# EAGLE design 549-anamdev-forceSensor (EAGLE 8.0.0)

## Sheet 1 of 2
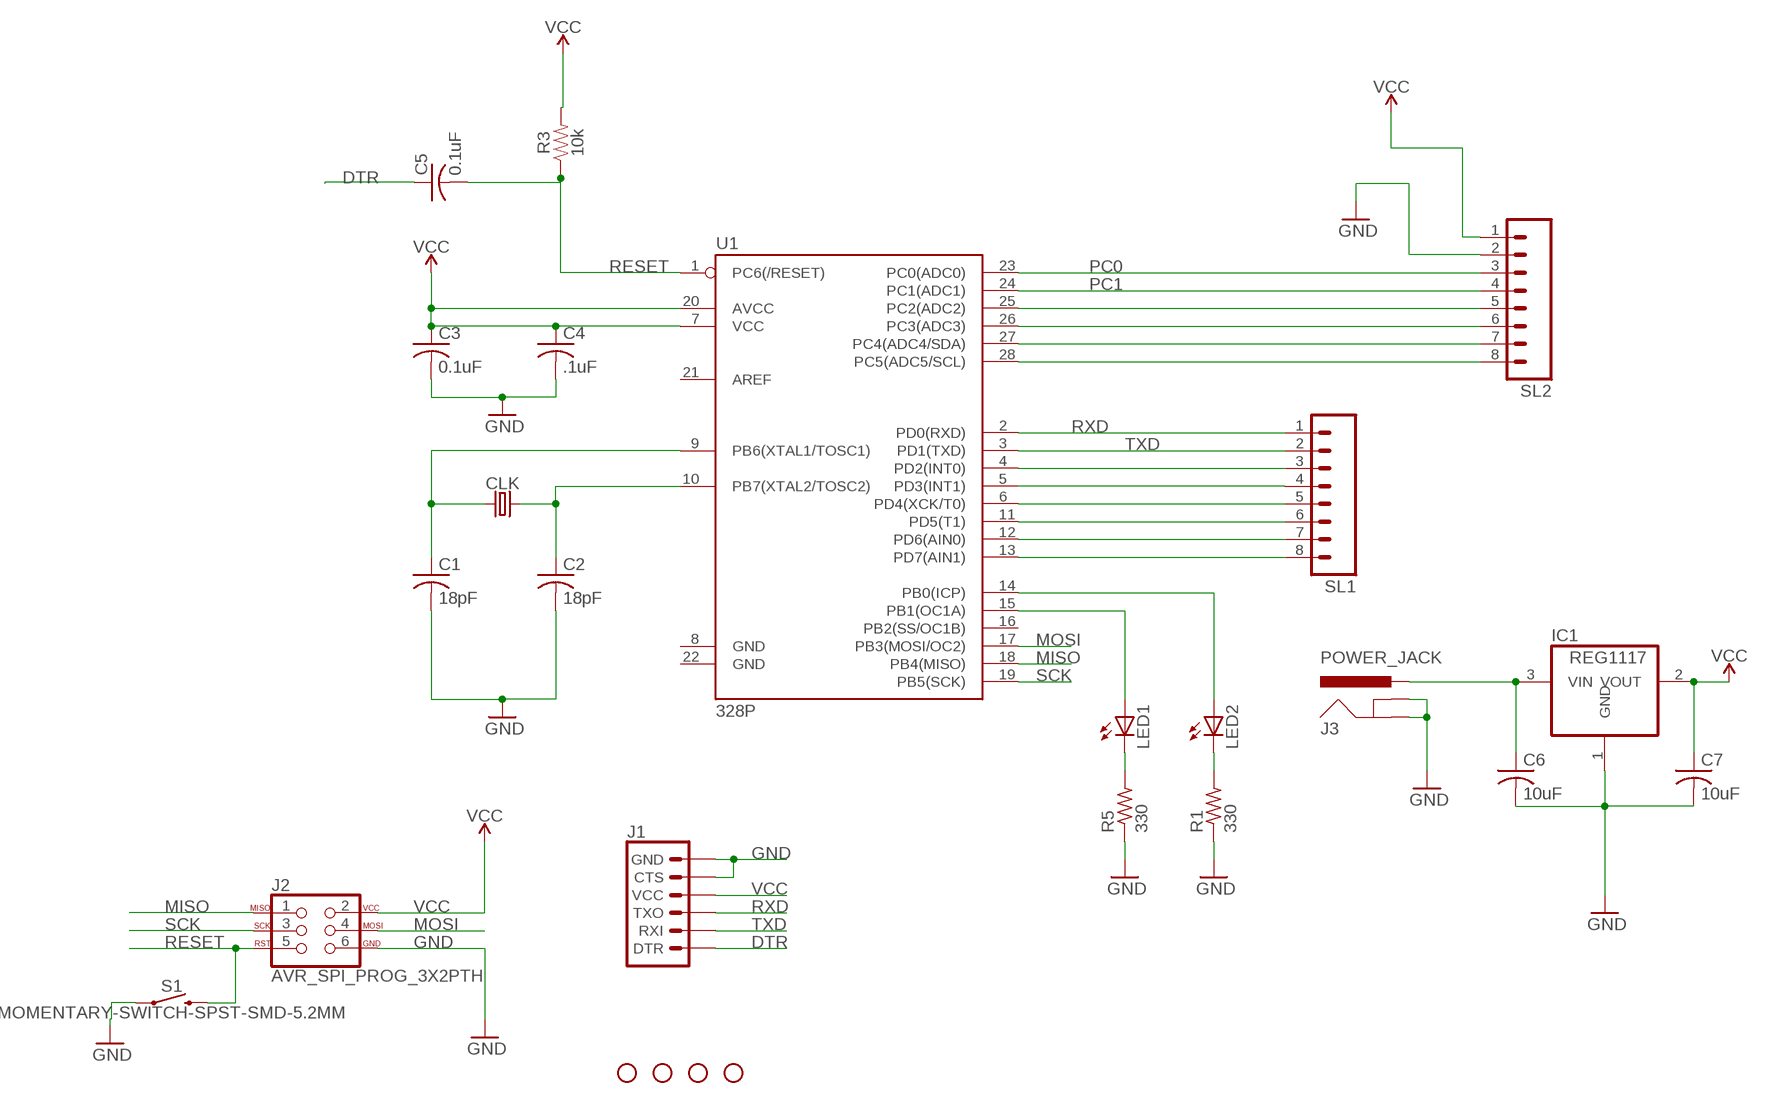
[diagram p0: schematic, sheet 1]

### Parts
C1  18pF  C-USC1206  [C1206]
C2  18pF  C-USC1206  [C1206]
C3  0.1uF  C-USC1206  [C1206]
C4  .1uF  C-USC1206  [C1206]
C5  0.1uF  C-USC1206  [C1206]
C6  10uF  C-USC1206  [C1206]
C7  10uF  C-USC1206  [C1206]
CLK  CRYSTALSMD-HC49UP  [HC49UP]
H1  STAND-OFF  [STAND-OFF]
H2  STAND-OFF  [STAND-OFF]
H3  STAND-OFF  [STAND-OFF]
H4  STAND-OFF  [STAND-OFF]
IC1  REG1117  [SOT223]
J1  6_PIN_SERIAL_TARGET  [1X06]
J2  AVR_SPI_PROG_3X2PTH  [2X3]
J3  POWER_JACK  [POWER_JACK_PTH]
LED1  LED1206  [LED-1206]
LED2  LED1206  [LED-1206]
R1  330  R-US_R1206  [R1206]
R3  10k  10OHM-1206-1/4W-1%  [1206]
R5  330  R-US_R1206  [R1206]
S1  MOMENTARY-SWITCH-SPST-SMD-5.2MM  [TACTILE_SWITCH_SMD_5.2MM]
SL1  M08  [08P]
SL2  M08  [08P]
U1  328P  ATMEGA328P_PDIP  [DIP28]

### Nets
DTR: C5.1 J1.1(DTR)
GND: C1.2 C2.2 C3.2 C4.2 C6.2 C7.2 IC1.1(GND) J1.5(CTS) J1.6(GND) J2.6 J3.GND J3.GNDBREAK R1.1 R5.1 S1.1 SL2.2 ; also sheet 2
MISO: J2.1 U1.18(PB4(MISO))
MOSI: J2.4 U1.17(PB3(MOSI/OC2))
N$1: LED2.A U1.14(PB0(ICP))
N$2: LED1.C R5.2
N$3: LED1.A U1.15(PB1(OC1A))
N$4: LED2.C R1.2
N$5: C6.1 IC1.3(VIN) J3.PWR
N$7: SL2.6 U1.26(PC3(ADC3))
N$9: SL1.5 U1.6(PD4(XCK/T0))
N$10: SL1.6 U1.11(PD5(T1))
N$11: SL1.7 U1.12(PD6(AIN0))
N$12: SL1.8 U1.13(PD7(AIN1))
N$14: SL1.3 U1.4(PD2(INT0))
N$15: SL1.4 U1.5(PD3(INT1))
N$21: C1.1 CLK.1 U1.9(PB6(XTAL1/TOSC1))
N$22: C2.1 CLK.2 U1.10(PB7(XTAL2/TOSC2))
PC0: SL2.3 U1.23(PC0(ADC0)) ; also sheet 2
PC1: SL2.4 U1.24(PC1(ADC1)) ; also sheet 2
PC2: SL2.5 U1.25(PC2(ADC2))
RESET: C5.2 J2.5 R3.1 S1.3 U1.1(PC6(/RESET))
RXD: J1.3(TXO) SL1.1 U1.2(PD0(RXD))
SCK: J2.3 U1.19(PB5(SCK)) ; also sheet 2
SCL: SL2.8 U1.28(PC5(ADC5/SCL))
SDA: SL2.7 U1.27(PC4(ADC4/SDA))
TXD: J1.2(RXI) SL1.2 U1.3(PD1(TXD))
VCC: C3.1 C4.1 C7.1 IC1.2(VOUT) J1.4(VCC) J2.2 R3.2 SL2.1 U1.7(VCC) U1.20(AVCC) ; also sheet 2
Unconnected: U1.8(GND) U1.16(PB2(SS/OC1B)) U1.21(AREF) U1.22(GND)

## Sheet 2 of 2
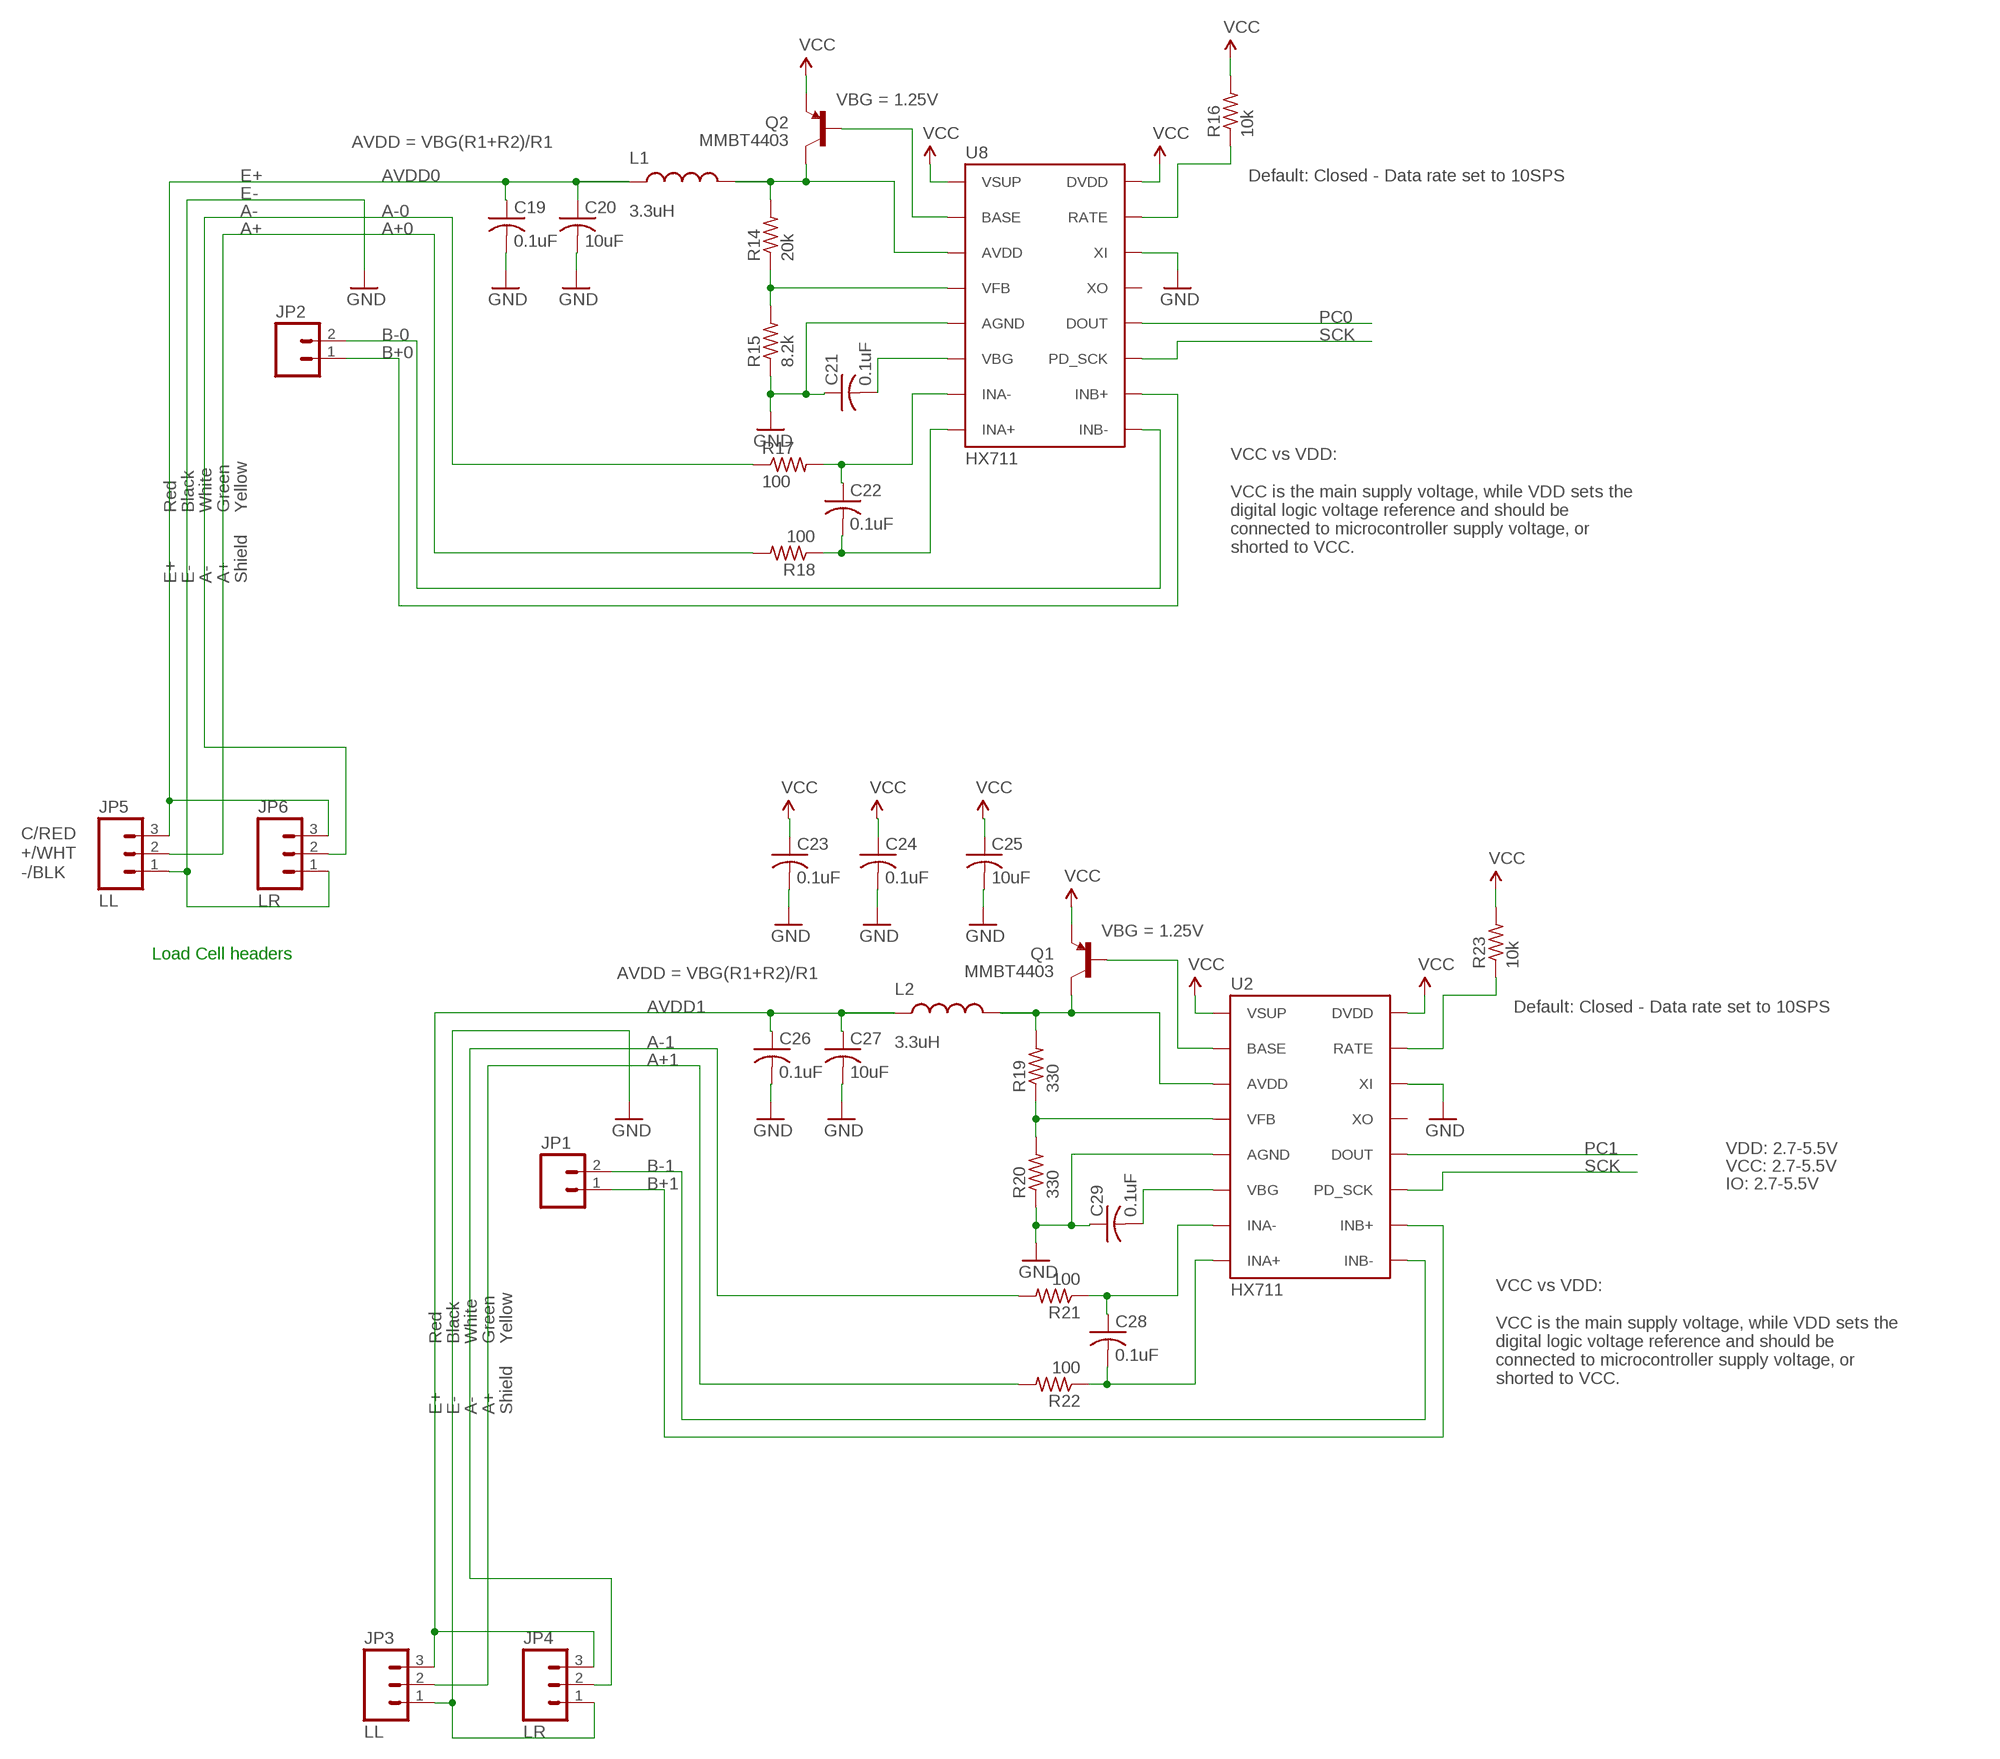
[diagram p1: schematic, sheet 2]

### Parts
C19  0.1uF  C-USC1206  [C1206]
C20  10uF  C-USC1206  [C1206]
C21  0.1uF  C-USC1206  [C1206]
C22  0.1uF  C-USC1206  [C1206]
C23  0.1uF  C-USC1206  [C1206]
C24  0.1uF  C-USC1206  [C1206]
C25  10uF  C-USC1206  [C1206]
C26  0.1uF  C-USC1206  [C1206]
C27  10uF  C-USC1206  [C1206]
C28  0.1uF  C-USC1206  [C1206]
C29  0.1uF  C-USC1206  [C1206]
JP1  M02PTH  [1X02]
JP2  M02PTH  [1X02]
JP3  LL  M03PTH  [1X03]
JP4  LR  M03PTH  [1X03]
JP5  LL  M03PTH  [1X03]
JP6  LR  M03PTH  [1X03]
L1  3.3uH  INDUCTOR0805-IND  [0805]
L2  3.3uH  INDUCTOR0805-IND  [0805]
Q1  MMBT4403  TRANSISTOR_PNPMMBT4403  [SOT23-3]
Q2  MMBT4403  TRANSISTOR_PNPMMBT4403  [SOT23-3]
R14  20k  R-US_R1206  [R1206]
R15  8.2k  R-US_R1206  [R1206]
R16  10k  R-US_R1206  [R1206]
R17  100  R-US_R1206  [R1206]
R18  100  R-US_R1206  [R1206]
R19  330  R-US_R1206  [R1206]
R20  330  R-US_R1206  [R1206]
R21  100  R-US_R1206  [R1206]
R22  100  R-US_R1206  [R1206]
R23  10k  R-US_R1206  [R1206]
U2  HX711  HX711HX711  [SO16]
U8  HX711  HX711HX711  [SO16]

### Nets
A+0: JP5.2 R18.2
A+1: JP3.2 R22.2
A-0: JP6.2 R17.1
A-1: JP4.2 R21.2
AVDD0: C19.1 C20.1 JP5.3 JP6.3 L1.1
AVDD1: C26.1 C27.1 JP3.3 JP4.3 L2.1
B+0: JP2.1 U8.10(INB+)
B+1: JP1.1 U2.10(INB+)
B-0: JP2.2 U8.9(INB-)
B-1: JP1.2 U2.9(INB-)
GND: C19.2 C20.2 C21.1 C23.2 C24.2 C25.2 C26.2 C27.2 C29.1 JP3.1 JP4.1 JP5.1 JP6.1 R15.1 R20.1 U2.5(AGND) U2.14(XI) U8.5(AGND) U8.14(XI) ; also sheet 1
N$6: Q2.1(B) U8.2(BASE)
N$8: R14.1 R15.2 U8.4(VFB)
N$13: C21.2 U8.6(VBG)
N$16: L1.2 Q2.3(C) R14.2 U8.3(AVDD)
N$17: R16.1 U8.15(RATE)
N$18: C22.1 R17.2 U8.7(INA-)
N$19: C22.2 R18.1 U8.8(INA+)
N$20: Q1.1(B) U2.2(BASE)
N$23: R19.1 R20.2 U2.4(VFB)
N$24: C29.2 U2.6(VBG)
N$25: L2.2 Q1.3(C) R19.2 U2.3(AVDD)
N$26: R23.1 U2.15(RATE)
N$27: C28.1 R21.1 U2.7(INA-)
N$28: C28.2 R22.1 U2.8(INA+)
PC0: U8.12(DOUT) ; also sheet 1
PC1: U2.12(DOUT) ; also sheet 1
SCK: U2.11(PD_SCK) U8.11(PD_SCK) ; also sheet 1
VCC: C23.1 C24.1 C25.1 Q1.2(E) Q2.2(E) R16.2 R23.2 U2.1(VSUP) U2.16(DVDD) U8.1(VSUP) U8.16(DVDD) ; also sheet 1
Unconnected: U2.13(XO) U8.13(XO)

### Notes on the sheet
- VBG = 1.25V
- AVDD = VBG(R1+R2)/R1
- E+ | Default: Closed - Data rate set to 10SPS
- E-
- A-
- A+
- Red | Black | White | Green | Yellow
- VCC vs VDD:
  
  VCC is the main supply voltage, while VDD sets the
  digital logic voltage reference and should be
  connected to microcontroller supply voltage, or
  shorted to VCC.
- E+ | E- | A- | A+ | Shield
- C/RED
- +/WHT
- -/BLK
- VBG = 1.25V
- Load Cell headers
- AVDD = VBG(R1+R2)/R1
- Default: Closed - Data rate set to 10SPS
- VDD: 2.7-5.5V
- VCC: 2.7-5.5V
- IO: 2.7-5.5V
- Red | Black | White | Green | Yellow
- VCC vs VDD:
  
  VCC is the main supply voltage, while VDD sets the
  digital logic voltage reference and should be
  connected to microcontroller supply voltage, or
  shorted to VCC.
- E+ | E- | A- | A+ | Shield

## Library data of the parts
C1-C7 C19-C29 = rcl:C-US: CAPACITOR, American symbol
CLK = SparkFun-Clocks:CRYSTAL: Crystals (Generic) These are passive quartz crystals, which can be used as a clock source for a microcontroller. Crystal's are two-terminal devices. They require external "load" capacitors to generate an oscillating signal.
H1-H4 = SparkFun-Hardware:STAND-OFF: Stand Off Drill holes for mechanically mounting via screws, standoffs, etc. Note: Use the keepout ring to avoid running the screw head into surrounding components. Variant Overviews STAND-OFF - Mechanical footprint for a #4 phillips button head screw. STAND-OFF-TIGHT - Mechanical footprint for a #4 phillips button head screw, Example SparkFun Products Screw - Phillips Head (1/4", 4-40, 10 pack) <https://www.sparkfun.com/products/10453> (PRT-10453) Screw - Phillips Head (1/2", 4-40, 10 pack) <https://www.sparkfun.com/products/10452> (PRT-10452) Screw - Phillips Head (3/4", 4-40, 10 pack) <https://www.sparkfun.com/products/10451> (PRT-10451) Screw - Phillips Head (1", 4-40, 10 pack) <https://www.sparkfun.com/products/10450> (PRT-10450)
IC1 = burr-brown:REG1117: 800mA and 1A Low Dropout (LDO) Positive Regulator 1.8V, 2.5V, 2.85V, 3.3V, 5V, and Adj; MPN: REG1117; OC_FARNELL: 1097566; OC_NEWARK: 14P6981
J1 = SparkFun-Connectors:6_PIN_SERIAL_TARGET: 6-pin header connection for use with the "FTDI BASIC" pinout - TARGET SIDE. Also known as "Arduino Serial Program Header". It is used to mate with our FTDI Basic serial programmers using the Arduino IDE. Note, this device has "TARGET" in the name. It is intended to be used on a design that contains a target micro-controller that you wish to program. The "sister" device, named "CABLE" is inteneded to be used on a design that usually lives on the end of your USB cable and prvides the converter chip (FTDI232 or FTDI231x) to commnicate serial RX/TX. You can populate with some of these: Break Away Headers - Straight <https://www.sparkfun.com/products/116> (PRT-00116) For reference (or to suit your programming needs) check out these designs: SparkFun FTDI Basic Breakout - 5V <https://www.sparkfun.com/products/9716> (DEV-09716) SparkFun FTDI Basic Breakout - 3.3V <https://www.sparkfun.com/products/9873> (DEV-09873) SparkFun FTDI SmartBasic <https://www.sparkfun.com/products/12935> (DEV-12935) SparkFun Beefy 3 - FTDI Basic Breakout <https://www.sparkfun.com/products/13746> (DEV-13746)
J2 = SparkFun-Connectors:AVR_SPI_PROG_3X2: AVR ISP 6 Pin This is the reduced ISP connector for AVR programming. Common on Arduino. This footprint will take up less PCB space and can be used with a 10-pin to 6-pin adapter such as SKU: BOB-08508 **Special note about "TEST_POINT" package. The stop mask is on the top side, so if you want your programming test points to be on the bottom of your board, make sure to place this package on the bottom side of the board. This also ensure that the orientation to program from the bottom side will be correct. SparkFun Products: SparkFun ISP Pogo Adapter <https://www.sparkfun.com/products/11591> - NS Tiny AVR Programmer <https://www.sparkfun.com/products/11801> -PTH
J3 = SparkFun-Connectors:POWER_JACK: Power Jack Connector This is the standard 5.5mm barrel jack for power. The PTH is the most common, proven, reliable, footprint. The Slot footprint only works if the mill layer is transmitted to the PCB fab house so be warned. Here are the connectors we sell at SparkFun: DC Barrel Power Jack/Connector <https://www.sparkfun.com/products/119> (PRT-00119) DC Barrel Power Jack/Connector (SMD) <https://www.sparkfun.com/products/12748> (PRT-12748) DC Barrel Jack Adapter - Breadboard Compatible <https://www.sparkfun.com/products/10811> (PRT-10811) It is used on this SparkFun product (and many, many others): SparkFun RedBoard - Programmed with Arduino <https://www.sparkfun.com/products/12757> (DEV-12757) Also, if you need a mating power supply or connector, please check these out: Wall Adapter Power Supply - 9VDC 650mA <https://www.sparkfun.com/products/298> (TOL-00298) DC Barrel Jack Adapter - Male <https://www.sparkfun.com/products/10287> (PRT-10287); PROD_ID: CONN-08197
JP1 JP2 = SparkFun-Connectors:M02: Standard 2-pin 0.1" header. Use with - straight break away headers ( PRT-00116) - right angle break away headers (PRT-00553) - swiss pins (PRT-00743) - machine pins (PRT-00117) - female headers (PRT-00115) Molex polarized connector foot print use with: PRT-08233 with associated crimp pins and housings. 2.54_SCREWTERM for use with PRT-10571. 3.5mm Screw Terminal footprints for PRT-08084 5mm Screw Terminal footprints for use with PRT-08432
JP3-JP6 = SparkFun-Connectors:M03: Header 3 Standard 3-pin 0.1" header. Use with straight break away headers (SKU : PRT-00116), right angle break away headers (PRT-00553), swiss pins (PRT-00743), machine pins (PRT-00117), and female headers (PRT-00115). Molex polarized connector foot print use with SKU : PRT-08232 with associated crimp pins and housings.
L1 L2 = SparkFun-Passives:INDUCTOR: Inductors Basic Inductor/Choke - 0603 and 1206. Footprints are not proven and vary greatly between part numbers. INDUCTOR POWER 3.3UH 4.0A SMD 0.197" L x 0.197" W x 0.177" H (5.00mm x 5.00mm x 4.50mm); PROD_ID: NDUC-13076
LED1 LED2 = SparkFun-Retired:LED: LEDs Standard schematic elements and footprints for 5mm, 3mm, 1206, and 0603 sized LEDs. 5mm - Spark Fun Electronics SKU : Comp-SBL
Q1 Q2 = SparkFun-DiscreteSemi:TRANSISTOR_PNP: Generic PNP BJT Double check pinouts against datasheets- not all devices are the same! MMBT3906 - 40V 200mA SOT-23 (TRANS-08052) MMBT4403 - 40V 600mA SOT-23 (TRANS-09245); PROD_ID: TRANS-09245
R1 R5 R14-R23 = rcl:R-US_: RESISTOR, American symbol
R3 = SparkFun-Resistors:10OHM: 10Ω resistor A resistor is a passive two-terminal electrical component that implements electrical resistance as a circuit element. Resistors act to reduce current flow, and, at the same time, act to lower voltage levels within circuits. - Wikipedia; PROD_ID: RES-08705; VALUE: 10
S1 = SparkFun-Switches:MOMENTARY-SWITCH-SPST: Momentary Switch (Pushbutton) - SPST Normally-open (NO) SPST momentary switches (buttons, pushbuttons). Variants PTH-12MM - 12mm square, through-hole Momentary Pushbutton Switch - 12mm Square <https://www.sparkfun.com/products/9190> (COM-09190) PTH-6.0MM, PTH-6.0MM-KIT - 6.0mm square, through-hole Mini Pushbutton Switch <https://www.sparkfun.com/products/97> (COM-00097) KIT package intended for soldering kit's - only one side of pads' copper is exposed. PTH-RIGHT-ANGLE-KIT - Right-angle, through-hole Right Angle Tactile Button <https://www.sparkfun.com/products/10791> - Used on SparkFun BigTime Watch Kit <https://www.sparkfun.com/products/11734> SMD-12MM - 12mm square, surface-mount Tactile Button - SMD (12mm) <https://www.sparkfun.com/products/12993> (COM-12993) Used on SparkFun PicoBoard <https://www.sparkfun.com/products/11888> SMD-4.5MM - 4.5mm Square Trackball Switch Used on SparkFun Blackberry Trackballer Breakout <https://www.sparkfun.com/products/13169> SMD-4.6MMX2.8MM - 4.60mm x 2.80mm, surface mount Used on SparkFun SAMD21 Mini Breakout <https://www.sparkfun.com/products/13664> SMD-5.2MM, SMD-5.2-REDUNDANT - 5.2mm square, surface-mount Mini Pushbutton Switch - SMD <https://www.sparkfun.com/products/8720> (COM-08720) Used on Arduino Pro Mini <https://www.sparkfun.com/products/11114> REDUNDANT package connects both switch circuits together SMD-6.0X3.5MM - 6.0 x 3.5mm, surface mount Momentary Reset Switch SMD <https://www.sparkfun.com/products/8229> (COM-08229) SMD-6.2MM-TALL - 6.2mm square, surface mount Tactile Button - SMD (6mm) <https://www.sparkfun.com/products/12992> Used on SparkFun Digital Sandbox <https://www.sparkfun.com/products/12651> SMD-RIGHT-ANGLE - Right-angle, surface mount Used on SparkFun Block for Intel® Edison - Arduino <https://www.sparkfun.com/products/13036>; PROD_ID: SWCH-08247; SF_SKU: COM-08720
SL1 SL2 = con-amp-quick:M08: AMP QUICK CONNECTOR; OC_FARNELL: unknown; OC_NEWARK: unknown
U1 = SparkFun-IC-Microcontroller:ATMEGA328P_PDIP: Atmel 328P Through hole ATMEGA328P uC used in the Arduino 32kb flash, 1k EEPROM, 2k SRAM Datasheet <http://www.sparkfun.com/datasheets/Components/SMD/ATMega328.pdf> SparkFun Products Storefront component: AVR 28 Pin 20MHz 32K 6A/D - ATMega328P <https://www.sparkfun.com/products/9061> (COM-09061) SparkFun Simon Says - Through-Hole Soldering Kit <https://www.sparkfun.com/products/10547> (KIT-10547) SparkFun Learn to Solder - Simon Says <https://www.sparkfun.com/products/13708> (KIT-13708) SparkFun BigTime Watch Kit <https://www.sparkfun.com/products/11734> (KIT-11734) SparkFun ClockIt <https://www.sparkfun.com/products/10930> (KIT-10930) SparkFun Serial Enabled LCD Kit <https://www.sparkfun.com/products/10097> (LCD-10097) SparkFun Simon Tilts - Through Hole Soldering Kit <https://www.sparkfun.com/products/12634> (KIT-12634) SparkFun Frequency Counter Kit <https://www.sparkfun.com/products/10140> (KIT-10140) FabFM Radio Kit <https://www.sparkfun.com/products/11043> (KIT-11043) SparkFun Binary Blaster Kit <https://www.sparkfun.com/products/12037> (KIT-12037) SparkFun Metro-Gnome <https://www.sparkfun.com/products/9236> (KIT-09236) ATmega328 with Arduino Optiboot (Uno) <https://www.sparkfun.com/products/10524> (DEV-10524); PROD_ID: IC-09136
U2 U8 = Testing:HX711; PROD_ID: IC-12445

## Board
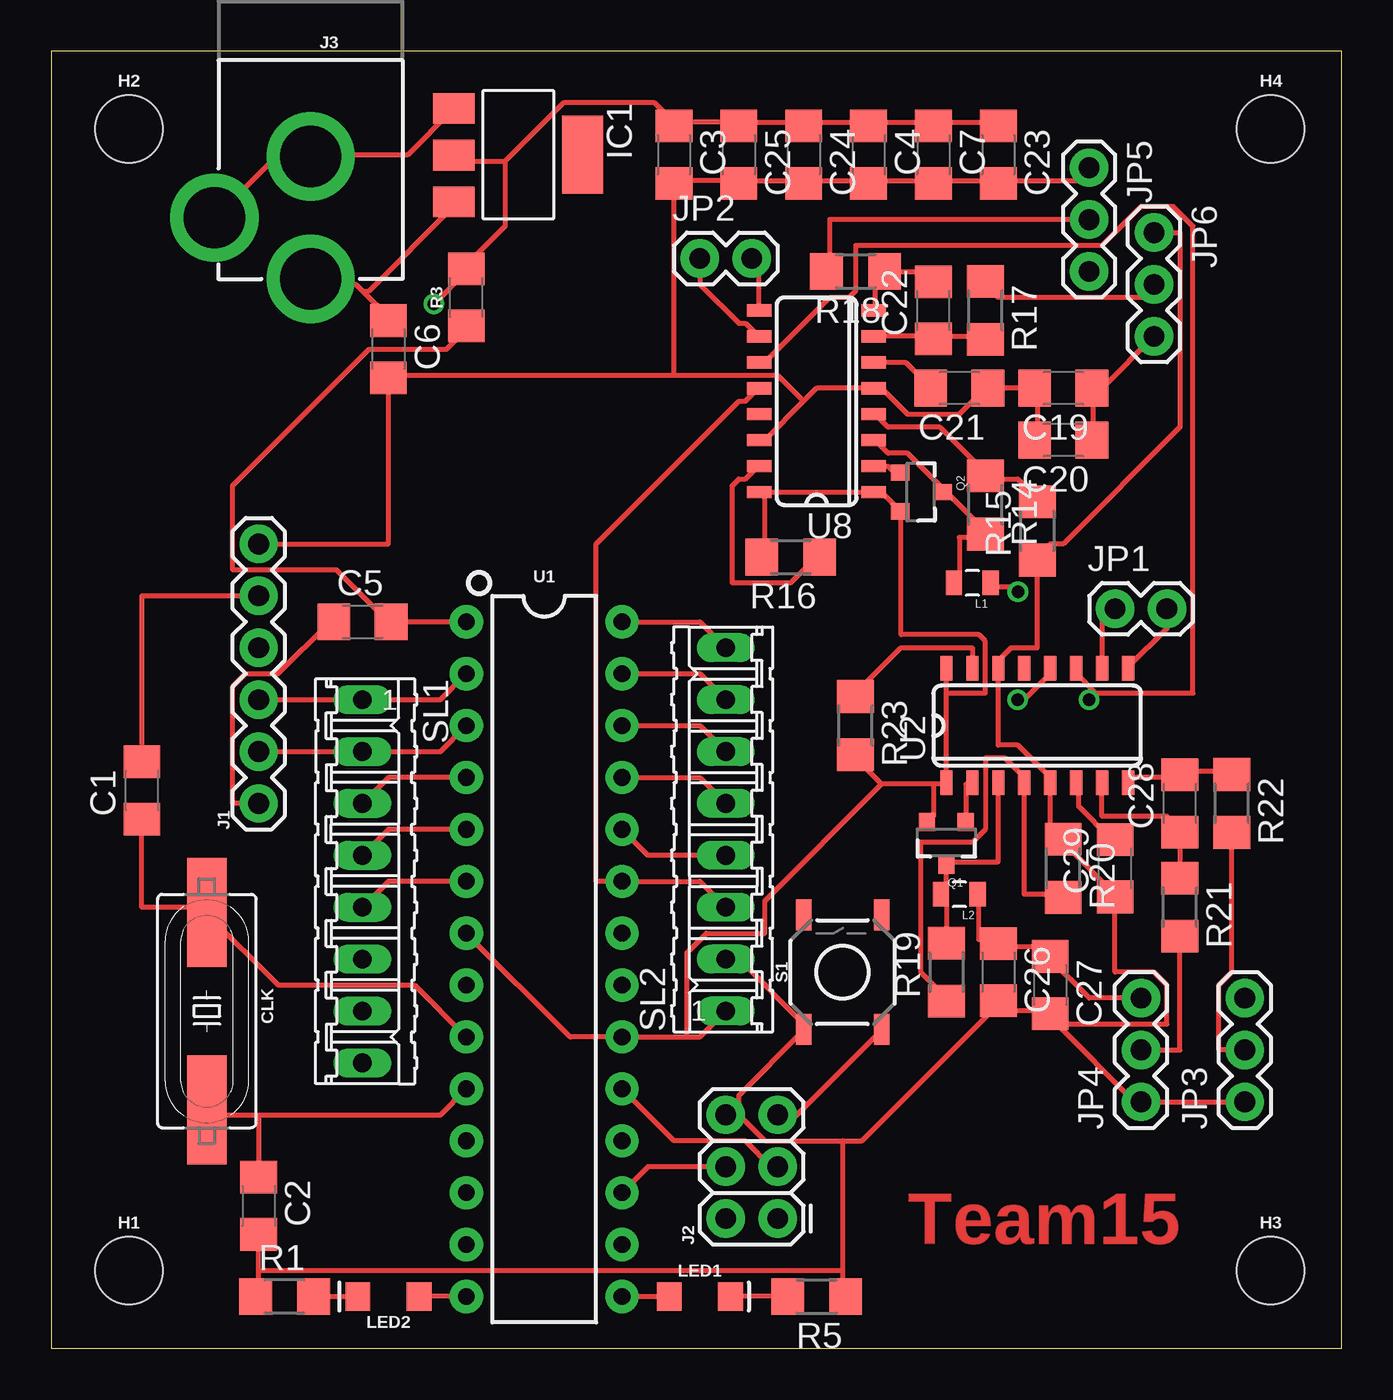
[diagram p2: board, top side]
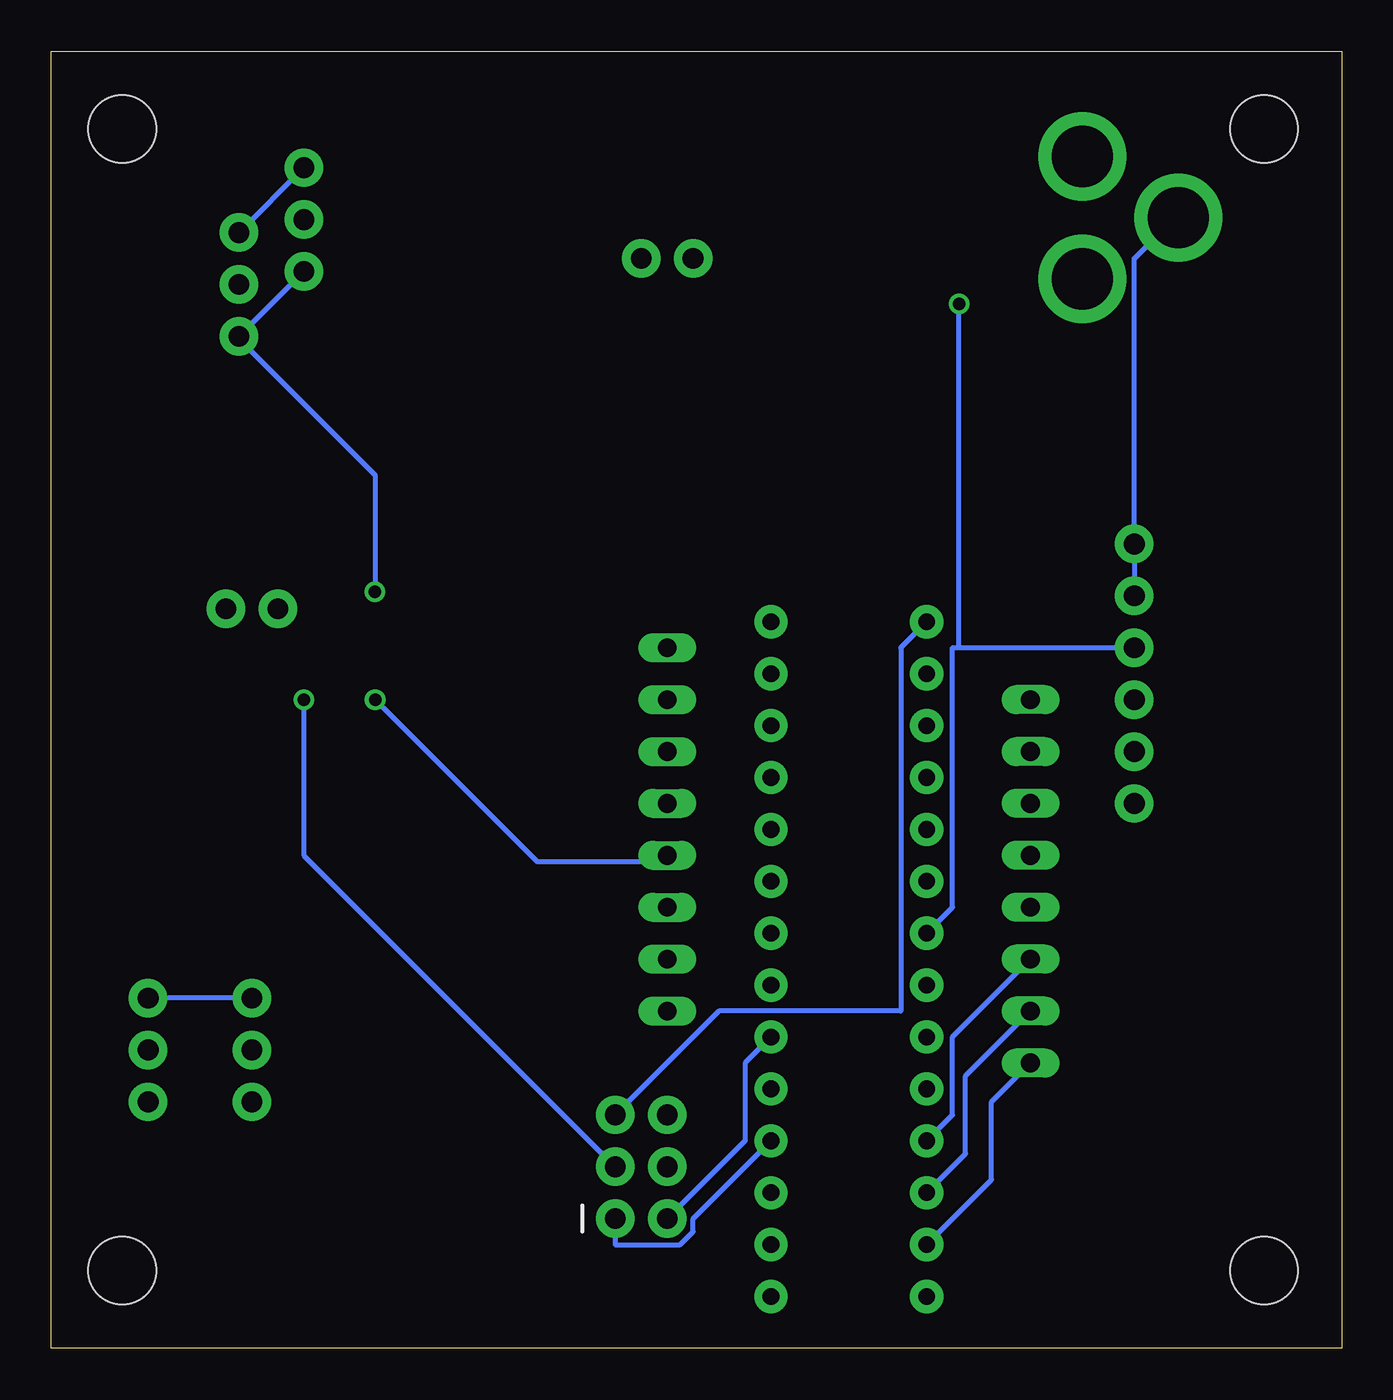
[diagram p3: board, bottom side, seen from below]

Size 63.17 x 63.49 mm. Coordinates in mm from the lower left corner, seen from the top.
Outline: 0,0 63.17,0 63.17,63.49 0,63.49 0,0
Copper layers (1*16): Top 0.035mm / dielectric 1.5mm / Bottom 0.035mm
Design rules "default": minimum track width 10mil, minimum drill 24mil, track to track 8mil, track to pad 8mil, pad to pad 8mil, via to via 8mil, smd to smd 8mil, copper to edge 40mil, drill to drill 8mil, minimum pad ring 10mil, minimum via ring 8mil, stop-mask expansion 4mil, vias tented up to drill 0mil, thermal gap 10mil

### Footprints (pad centres in the part's own frame; a part is rotated, then mirrored left to right if it is on the bottom)
C1206 = smd 1.6 x 1.8: 1 -1.4,0; 2 1.4,0
HC49UP = smd 5.334 x 1.93: 1 -4.826,0; 2 4.826,0
STAND-OFF = hole 3.302: 0,0
SOT223 = smd 1.499 x 2.007: 1 -2.261,-3.15; 2 0.025,-3.15; 3 2.311,-3.15 | smd 3.81 x 2.007: 4 0,3.15
1X06 = drill 1.016 pad 1.88: 1 0,0; 2 2.54,0; 3 5.08,0; 4 7.62,0; 5 10.16,0; 6 12.7,0
2X3 = drill 1.016 pad 1.88: 1 0,0; 2 0,2.54; 3 2.54,0; 4 2.54,2.54; 5 5.08,0; 6 5.08,2.54
POWER_JACK_PTH = drill 2.997 pad 4.318: GND 0,7.7; GNDBREAK 4.7,10.7; PWR 0,13.7
1X02 = drill 1.016 pad 1.88: 1 0,0; 2 2.54,0
1X03 = drill 1.016 pad 1.88: 1 0,0; 2 2.54,0; 3 5.08,0
0805 = smd 0.8 x 1.2: 1 -0.9,0; 2 0.9,0
LED-1206 = smd 1.2 x 1.4: A -1.5,0; C 1.5,0
SOT23-3 = smd 0.8 x 0.9: 1 -0.95,-1; 2 0.95,-1; 3 0,1.1
R1206 = smd 1.6 x 1.803: 1 -1.422,0; 2 1.422,0
1206 = smd 1.6 x 1.8: 1 -1.4,0; 2 1.4,0
TACTILE_SWITCH_SMD_5.2MM = smd 1.524 x 0.762: 1 -2.794,1.905; 2 2.794,1.905; 3 -2.794,-1.905; 4 2.794,-1.905
08P = drill 0.914 long: 1 -8.89,0; 2 -6.35,0; 3 -3.81,0; 4 -1.27,0; 5 1.27,0; 6 3.81,0; 7 6.35,0; 8 8.89,0
DIP28 = drill 0.813 pad 1.626: 1 -16.51,-3.81; 2 -13.97,-3.81; 3 -11.43,-3.81; 4 -8.89,-3.81; 5 -6.35,-3.81; 6 -3.81,-3.81; 7 -1.27,-3.81; 8 1.27,-3.81; 9 3.81,-3.81; 10 6.35,-3.81; 11 8.89,-3.81; 12 11.43,-3.81; 13 13.97,-3.81; 14 16.51,-3.81; 15 16.51,3.81; 16 13.97,3.81; 17 11.43,3.81; 18 8.89,3.81; 19 6.35,3.81; 20 3.81,3.81; 21 1.27,3.81; 22 -1.27,3.81; 23 -3.81,3.81; 24 -6.35,3.81; 25 -8.89,3.81; 26 -11.43,3.81; 27 -13.97,3.81; 28 -16.51,3.81
SO16 = smd 0.6 x 1.2: 1 -4.445,-2.8; 2 -3.175,-2.8; 3 -1.905,-2.8; 4 -0.635,-2.8; 5 0.635,-2.8; 6 1.905,-2.8; 7 3.175,-2.8; 8 4.445,-2.8; 9 4.445,2.8; 10 3.175,2.8; 11 1.905,2.8; 12 0.635,2.8; 13 -0.635,2.8; 14 -1.905,2.8; 15 -3.175,2.8; 16 -4.445,2.8

### Placement (x,y rotation side)
C1  4.45,27.3 90 top
C2  10.16,6.99 270 top
C3  30.48,58.42 270 top
C4  40.01,58.42 270 top
C5  15.24,35.56 0 top
C6  16.51,48.9 270 top
C7  43.18,58.42 270 top
C19  49.53,46.99 180 top
C20  49.53,44.45 180 top
C21  44.45,46.99 180 top
C22  43.18,50.8 90 top
C23  46.35,58.42 270 top
C24  36.83,58.42 270 top
C25  33.66,58.42 270 top
C26  46.35,18.41 270 top
C27  48.9,17.78 270 top
C28  55.24,26.67 90 top
C29  52.07,23.5 90 top
CLK  7.62,16.51 270 top
H1  3.81,3.81 0 top
H2  3.81,59.69 0 top
H3  59.69,3.81 0 top
H4  59.69,59.69 0 top
IC1  22.86,58.42 270 top
J1  10.16,26.67 90 top
J2  35.56,6.35 90 top
J3  12.7,66.04 180 top
JP1  52.07,36.2 0 top
JP2  31.75,53.34 0 top
JP3  58.42,12.06 90 top
JP4  53.34,12.06 90 top
JP5  50.8,57.78 270 top
JP6  53.98,54.61 270 top
L1  45.09,37.47 180 top
L2  44.45,22.23 180 top
LED1  31.75,2.54 0 top
LED2  16.51,2.54 180 top
Q1  43.81,24.77 180 top
Q2  42.55,41.91 270 top
R1  11.43,2.54 0 top
R3  20.32,51.44 90 top
R5  37.47,2.54 180 top
R14  45.72,41.27 270 top
R15  48.26,40.01 90 top
R16  36.2,38.73 180 top
R17  45.72,50.8 270 top
R18  39.37,52.7 180 top
R19  43.81,18.41 90 top
R20  49.53,23.5 270 top
R21  55.24,21.59 270 top
R22  57.78,26.67 270 top
R23  39.37,30.48 270 top
S1  38.73,18.41 90 top
SL1  15.24,22.86 270 top
SL2  33.02,25.4 90 top
U1  24.13,19.05 270 top
U2  48.26,30.48 0 top
U8  37.47,46.35 90 top

### Tracks (layer width: path | path; a pad name or v marks a point on that pad's centre or on a via)
A+0
  Top 0.254: JP5.2 38.1,55.24 38.1,52.7 R18.2
A+1
  Top 0.254: R22.2 57.78,18.41 57.15,17.78 57.15,14.61 JP3.2
A-0
  Top 0.254: JP6.2 53.34,51.44 46.35,51.44 45.72,52.07 R17.1
A-1
  Top 0.254: R21.2 55.24,14.61 JP4.2
AVDD0  (via drill 0.61)
  Top 0.254: 51.44,46.99 51.49,47.04 | 51.49,47.04 JP6.3 | C20.1 50.98,44.58 50.98,46.86 C19.1 50.98,47.09 51.44,47.09 51.49,47.04 | v47.32,37.03 47.09,37.26 46.18,37.26 L1.1
  Bottom 0.254: JP5.3 JP6.3 53.95,49.38 47.32,42.75 v47.32,37.03
AVDD1
  Top 0.254: 48.95,19 50.8,17.14 JP4.3 | 48.95,19 48.9,19.05 | 46.35,20 46.18,20 | 46.18,20 45.4,20 45.4,22.23 L2.1 | 46.35,19.68 46.41,19.68 | 46.41,19.68 48.58,19.68 48.9,19.37 C27.1 48.92,18.97 48.95,19 | 46.18,20 46.18,19.89 C26.1 46.41,19.66 46.41,19.68
  Bottom 0.254: JP4.3 JP3.3
B+0
  Top 0.254: JP2.1 31.75,52.07 33.66,50.16 33.97,50.16 34.61,49.53 U8.10
B+1
  Top 0.254: U2.10 51.44,36.2 JP1.1
B-0
  Top 0.254: JP2.2 34.61,53.34 34.61,50.8 U8.9
B-1
  Top 0.254: JP1.2 54.61,35.24 52.7,33.34 U2.9
DTR
  Top 0.254: J1.1 8.89,26.67 8.89,32.38 9.53,33.02 11.11,33.02 13.65,35.56 C5.1
GND
  Top 0.254: 46.35,16.83 46.67,16.51 48.9,16.51 C27.2 | 49.21,15.88 53.02,12.06 JP4.1 JP3.1 | 49.21,15.88 48.9,16.19 C27.2 | SL2.2 33.66,19.05 36.83,15.88 S1.1 36.83,15.56 33.66,12.38 33.66,11.43 | 10.16,3.81 10.16,2.54 R1.1 | 10.16,3.81 C2.2 | 38.73,10.16 38.73,3.81 | 38.73,3.81 38.73,2.54 R5.1 | 38.73,10.16 34.92,10.16 33.66,11.43 | 38.73,3.81 10.16,3.81 | 33.66,11.43 J2.6 | 46.35,16.83 39.69,10.16 38.73,10.16 | 46.35,16.83 C26.2 | 49.21,15.88 54.61,15.88 54.61,17.78 53.98,18.41 52.07,18.41 C29.1 52.07,22.23 49.53,24.77 R20.1 49.53,25.08 48.9,25.08 U2.5 48.9,27.94 47.31,29.53 46.35,29.53 U2.14 46.35,33.66 46.99,34.29 48.26,34.29 R15.1 48.26,38.73 48.9,39.37 49.53,39.37 55.24,45.09 55.24,54.61 JP6.1 | 49.21,15.88 C27.2 | 33.66,57.15 30.48,57.15 C3.2 30.48,47.62 | 33.66,57.15 36.83,57.15 | 33.66,57.15 C25.2 | 36.83,57.15 40.01,57.15 | 36.83,57.15 C24.2 | 40.01,57.15 43.18,57.15 | 40.01,57.15 C4.2 | 43.18,57.15 46.35,57.15 | 43.18,57.15 C7.2 | JP5.1 50.16,57.15 46.35,57.15 | 46.35,57.15 C23.2 | IC1.1 19.68,60.64 17.46,58.42 12.7,58.42 J3.GND 12.7,58.1 10.79,58.1 8.26,55.56 J3.GNDBREAK | C1.2 4.45,36.83 J1.5 | C20.2 48.26,44.45 48.26,46.99 C19.2 C21.1 45.72,46.99 44.45,45.72 41.91,45.72 40.64,46.99 U8.5 37.47,46.99 36.83,46.35 | 36.83,46.35 34.92,44.45 U8.14 | J1.6 16.51,39.37 C6.2 16.51,47.62 30.48,47.62 | 36.83,46.35 35.56,47.62 30.48,47.62
  Bottom 0.254: JP5.1 JP6.1 | J1.5 J1.6 10.16,53.34 8.26,55.24 J3.GNDBREAK
MISO
  Bottom 0.254: U1.18 31.75,6.35 31.75,5.71 32.38,5.08 35.56,5.08 J2.1
MOSI
  Top 0.254: U1.17 29.21,8.89 J2.4
N$1
  Top 0.254: U1.14 LED2.A
N$2
  Top 0.254: R5.2 LED1.C
N$3
  Top 0.254: U1.15 LED1.A
N$4
  Top 0.254: R1.2 LED2.C
N$5
  Top 0.254: 15.24,51.75 14.92,52.07 12.7,52.07 J3.PWR | 15.24,51.75 16.51,50.48 C6.1 | 15.24,51.75 15.56,51.75 19.68,55.88 IC1.3
N$6
  Top 0.254: U8.2 40.96,43.18 41.27,42.86 Q2.1
N$7
  Top 0.254: SL2.6 31.75,30.48 U1.26
N$8
  Top 0.254: U8.4 40.32,45.72 40.96,45.09 43.5,45.09 45.72,42.86 R14.1 45.72,42.55 47.31,42.55 48.26,41.59 R15.2
N$9
  Top 0.254: SL1.5 16.51,22.86 U1.6
N$10
  Bottom 0.254: SL1.6 19.05,15.24 19.05,11.43 U1.11
N$11
  Bottom 0.254: SL1.7 18.41,13.34 18.41,9.53 U1.12
N$12
  Bottom 0.254: SL1.8 17.14,12.06 17.14,8.26 U1.13
N$13
  Top 0.254: U8.6 40.46,48.23 41.83,48.23 42.98,47.09 C21.2
N$14
  Top 0.254: SL1.3 16.51,27.94 U1.4
N$15
  Top 0.254: SL1.4 16.51,25.4 U1.5
N$16
  Top 0.254: 43.81,41.91 45.72,40.01 R14.2 45.72,39.69 44.45,39.69 44.45,37.47 L1.2 | 43.81,41.91 41.91,43.81 40.96,43.81 40.32,44.45 U8.3 | 43.81,41.91 Q2.3
N$17
  Top 0.254: U8.15 34.61,43.18 33.97,42.55 33.66,42.55 33.34,42.23 33.34,37.47 36.2,37.47 37.47,38.73 R16.1
N$18
  Top 0.254: 43.18,49.53 U8.7 | 43.18,49.53 45.72,49.53 R17.2 | 43.18,49.53 C22.1
N$19
  Top 0.254: U8.8 40.32,50.8 40.32,52.7 R18.1 42.86,52.7 43.18,52.39 C22.2
N$20
  Top 0.254: Q1.1 44.77,26.04 44.77,27.62 45.09,27.62 U2.2
N$21
  Top 0.254: C1.1 4.45,21.59 7.62,21.59 CLK.1 7.62,21.27 11.11,17.78 17.78,17.78 U1.9
N$22
  Top 0.254: 10.16,11.43 C2.1 | 10.16,11.43 7.62,11.43 CLK.2 | U1.10 19.05,11.43 10.16,11.43
N$23
  Top 0.254: R20.2 49.53,22.23 47.62,22.23 U2.4 47.62,27.94 46.67,28.89 45.72,28.89 45.72,25.4 45.09,24.77 42.55,24.77 42.55,18.41 43.81,17.14 R19.1
N$24
  Top 0.254: U2.6 50.29,27.66 50.29,26.52 51.89,24.92 C29.2
N$25
  Top 0.254: 43.81,22.23 Q1.3 43.81,23.81 46.35,23.81 U2.3 | 43.81,22.23 R19.2 | 43.81,22.23 L2.2
N$26
  Top 0.254: U2.15 45.09,34.29 41.59,34.29 39.37,32.07 R23.1
N$27
  Top 0.254: U2.7 51.44,26.04 54.61,26.04 55.24,25.4 C28.1 R21.1
N$28
  Top 0.254: U2.8 52.7,27.94 55.24,27.94 C28.2 55.24,28.26 57.78,28.26 R22.1
PC0
  Top 0.254: U8.12 34.61,46.99 33.97,46.35 33.66,46.35 26.67,39.37 26.67,22.86 U1.23 31.75,22.86 SL2.3
PC1  (via drill 0.61)
  Top 0.254: v47.31,31.75 47.62,31.75 48.9,33.02 U2.12 | U1.24 29.21,24.13 SL2.4
  Bottom 0.254: v47.31,31.75 39.37,23.81 33.02,23.81 SL2.4
PC2
  Top 0.254: SL2.5 31.75,27.94 U1.25
RESET
  Top 0.254: J2.5 36.51,11.43 40.64,15.56 S1.3 | U1.1 C5.2 16.51,35.56 13.97,38.1 8.89,38.1 8.89,42.23 15.56,48.9 19.37,48.9 20.32,49.85 R3.1
  Bottom 0.254: J2.5 30.48,16.51 21.59,16.51 21.59,34.29 U1.1
RXD
  Top 0.254: J1.3 SL1.1 19.05,31.75 U1.2
SCK  (via drill 0.61)
  Top 0.254: U1.19 30.48,10.16 33.97,10.16 35.24,8.89 J2.3 | 51.12,32.07 55.88,32.07 55.88,54.93 54.93,55.88 53.34,55.88 51.44,53.98 39.37,53.98 39.37,51.75 39.05,51.44 38.1,51.44 34.92,48.26 U8.11 | 51.12,32.07 50.16,33.02 U2.11 | 51.12,32.07 v50.8,31.75
  Bottom 0.254: J2.3 50.8,24.13 v50.8,31.75
SCL
  Top 0.254: SL2.8 31.75,35.56 U1.28
SDA
  Top 0.254: SL2.7 31.75,33.02 U1.27
TXD
  Top 0.254: J1.2 SL1.2 19.05,29.21 U1.3
VCC  (via drill 0.61)
  Top 0.254: 22.23,58.1 22.23,54.93 20.32,53.02 R3.2 20.32,52.7 v18.73,51.12 | 22.23,58.1 20,58.1 IC1.2 | 33.66,60.01 30.48,60.01 | 33.66,60.01 36.83,60.01 | 33.66,60.01 C25.1 | 36.83,60.01 40.01,60.01 | 36.83,60.01 C24.1 | 40.01,60.01 43.18,60.01 | 40.01,60.01 C4.1 | 43.18,60.01 46.35,60.01 C23.1 | 43.18,60.01 C7.1 | 22.23,58.1 25.08,60.96 29.53,60.96 30.48,60.01 | 30.48,60.01 C3.1 | 34.92,41.91 34.92,38.73 R16.2 | 34.92,41.91 U8.1 40.64,41.91 41.27,41.27 Q2.2 41.59,40.96 41.59,34.92 45.4,34.92 45.72,34.61 45.72,32.07 43.81,32.07 | 34.92,41.91 U8.16 | 43.18,27.62 43.18,26.04 Q1.2 | 43.18,27.62 43.81,27.62 U2.1 43.81,32.07 | 43.81,32.07 U2.16 | 40.64,27.62 39.37,28.89 R23.2 | 43.18,27.62 40.64,27.62 | SL2.1 31.75,15.24 31.11,15.24 | 31.11,15.24 U1.20 25.4,15.24 U1.7 | 40.64,27.62 34.92,21.91 34.92,20.32 32.07,20.32 31.11,19.37 31.11,15.24
  Bottom 0.254: 18.73,34.29 19.05,34.29 19.05,21.59 U1.7 | 18.73,34.29 J1.4 | J2.2 29.21,10.16 29.21,13.97 U1.20 | 18.73,34.29 v18.73,51.12

### Text on the board
Top: Team15